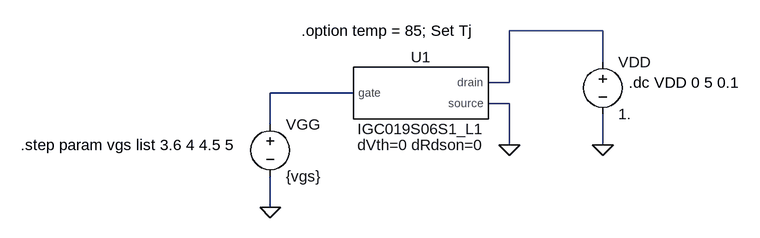
[diagram p0: schematic IGC.asc]
IGC.asc, the LTspice schematic file:
Version 4
SHEET 1 880 680
WIRE 480 48 336 48
WIRE 480 96 480 48
WIRE 336 128 336 48
WIRE 336 128 304 128
WIRE 96 144 -32 144
WIRE 336 160 304 160
WIRE -32 192 -32 144
WIRE 336 224 336 160
WIRE 480 224 480 176
WIRE -32 320 -32 272
FLAG 480 224 0
FLAG 336 224 0
FLAG -32 320 0
SYMBOL IGC019S06S1_L1 192 144 R0
SYMATTR InstName U1
SYMBOL voltage -32 176 R0
SYMATTR InstName VGG
SYMATTR Value {vgs}
SYMBOL voltage 480 80 R0
WINDOW 123 0 0 Left 0
WINDOW 39 0 0 Left 0
SYMATTR InstName VDD
SYMATTR Value 1.
TEXT -416 224 Left 2 !.step param vgs list 3.6 4 4.5 5
TEXT 520 128 Left 2 !.dc VDD 0 5 0.1
TEXT 16 48 Left 2 !.option temp = 85; Set Tj

The netlist it stands for:
* IGC.asc
XU1 N001 N002 0 IGC019S06S1_L1 dVth=0 dRdson=0  ; pins drain gate source
VGG N002 0 {vgs}
VDD N001 0 1.
.step param vgs list 3.6 4 4.5 5
.dc VDD 0 5 0.1
.option temp = 85; Set Tj
.lib ./CoolGaN.lib
.backanno
.end